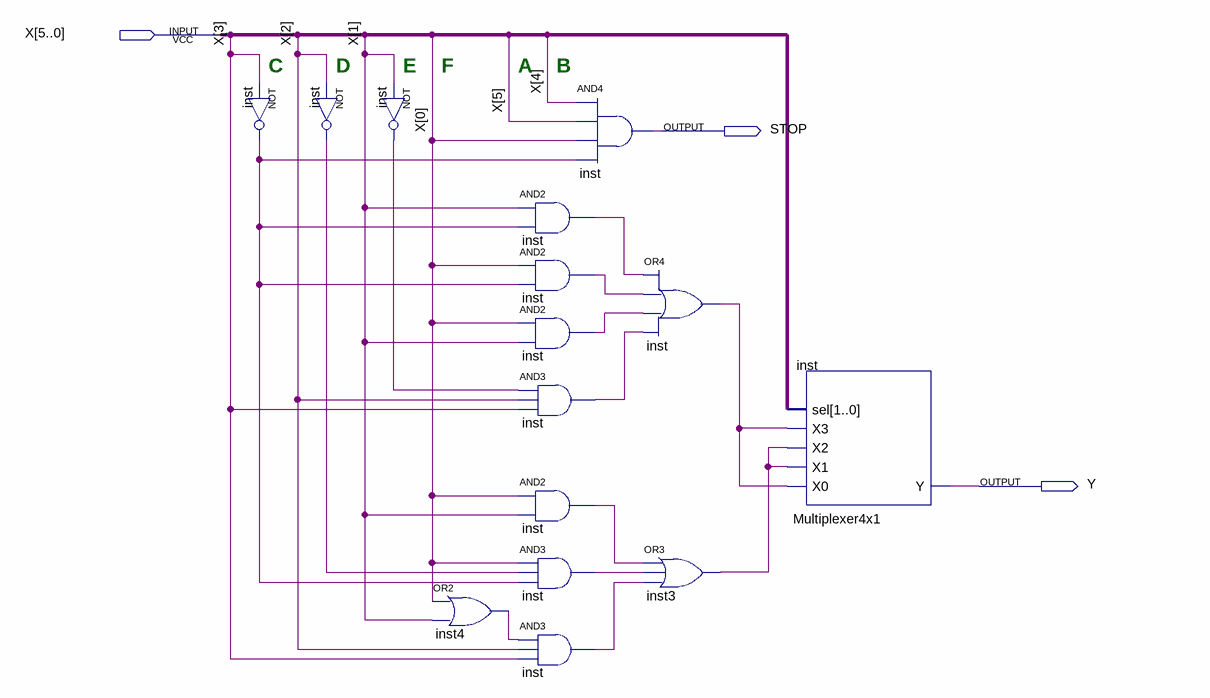
[diagram p0: schematic sheet]
// Quartus schematic MorseEA.bdf as structural Verilog: 15 symbols, 3 pins
module MorseEA (
  input  [5:0] X,
  output STOP,
  output Y
);

  wire inst3_out, inst4_out, inst_out, inst_out_2, inst_out_3, inst_out_4, inst_out_5, inst_out_6,
       inst_out_7, inst_out_8, inst_out_9, inst_out_10, inst_out_11;

  not inst (inst_out_10, X[3]);
  not inst_dup2 (inst_out_5, X[2]);
  not inst_dup3 (inst_out_11, X[1]);
  or inst4 (inst4_out, X[0], X[1]);
  and inst_dup4 (inst_out, X[1], inst_out_10);
  and inst_dup5 (inst_out_2, X[0], inst_out_10);
  and inst_dup6 (inst_out_3, X[0], X[1]);
  and inst_dup7 (inst_out_4, inst_out_11, X[2], X[3]);
  and inst_dup8 (inst_out_6, X[0], X[1]);
  and inst_dup9 (inst_out_8, X[0], inst_out_5, inst_out_10);
  and inst_dup10 (inst_out_7, inst4_out, X[2], X[3]);
  and inst_dup11 (STOP, X[4], X[5], X[0], inst_out_10);
  or inst_dup12 (inst_out_9, inst_out, inst_out_2, inst_out_3, inst_out_4);
  or inst3 (inst3_out, inst_out_6, inst_out_8, inst_out_7);
  Multiplexer4x1 inst_dup13 (.X0(inst_out_9), .X1(inst3_out), .X2(inst3_out), .X3(inst_out_9), .sel(X), .Y(Y));

  // Notes on the sheet:
  //   C
  //   D
  //   E
  //   F
  //   A
  //   B
endmodule
